# Altium schematic sheet cc_cv_charger.SchDoc
size B
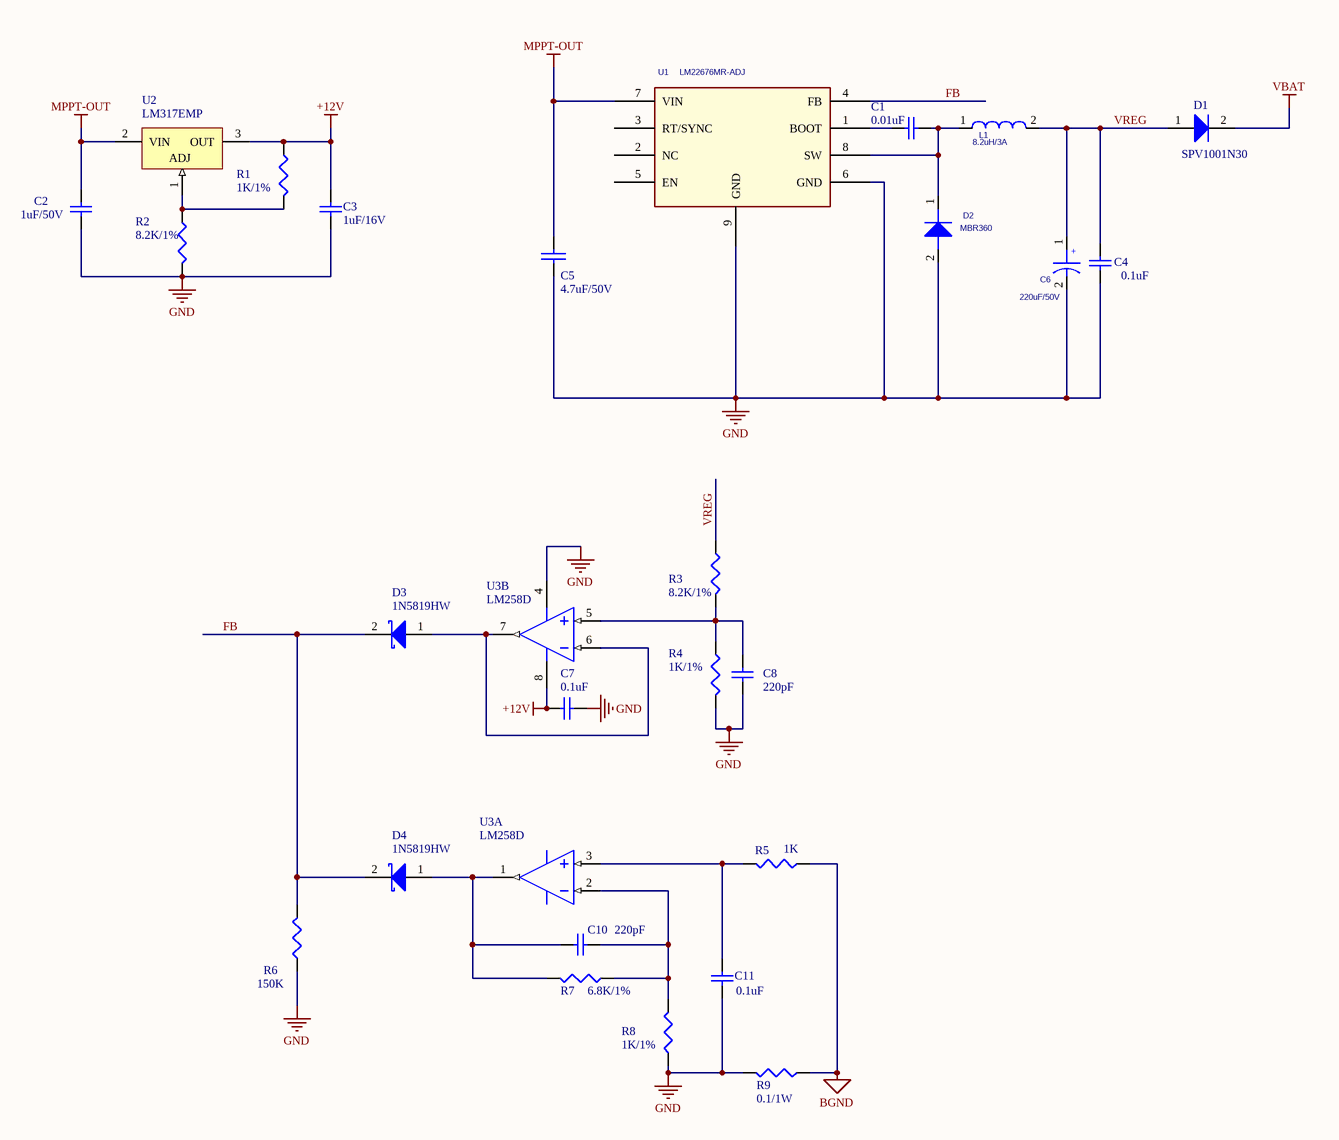
[diagram p0: cc_cv_charger.SchDoc]

## Parts
C1  0.01uF  [0603]
C2  1uF/50V  [1210]
C3  1uF/16V  [0805]
C4  0.1uF  [0603]
C5  4.7uF/50V  [1812]
C6  220uF/50V  [DL-10*10.5]
C7  0.1uF  [0603]
C8  220pF  [0603]
C10  220pF  [0603]
C11  0.1uF  [0603]
D1  SPV1001N30  [SPV1001]
D2  MBR360  [DO214AB]
D3  1N5819HW  [1N5819]
D4  1N5819HW  [1N5819]
L1  8.2uH/3A  [IND_8.2UH_3A]
R1  1K/1%  [0603]
R2  8.2K/1%  [0603]
R3  8.2K/1%  [0603]
R4  1K/1%  [0603]
R5  1K  [0603]
R6  150K  [0603]
R7  6.8K/1%  [0603]
R8  1K/1%  [0603]
R9  0.1/1W  [2512]
U1  LM22676MR-ADJ  [PSO8]
U2  LM317EMP  [LM317]
U3  LM258D  [SO8]  (parts A,B of 2)

## Nets
+12V: C3.2 C7.2 R1.1 U2.3(OUT) U3.8(V+)
BGND: R5.1 R9.1
GND: C2.1 C3.1 C4.1 C5.2 C6.2 C7.1 C8.2 C11.2 D2.2 R2.2 R4.2 R6.1 R8.1 R9.2 U1.6(GND) U1.9(GND) U3.4(GND)
MPPT-OUT: C2.2 C5.1 U1.7(VIN) U2.2(VIN)
VBAT: D1.2(K)
FB: D3.2(K) D4.2(K) R6.2 U1.4(FB)
VREG: C4.2 C6.1 D1.1(A) L1.2 R3.1
NetC1_1: C1.1 D2.1 L1.1 U1.8(SW)
NetC1_2: C1.2 U1.1(BOOT)
NetC8_1: C8.1 R3.2 R4.1 U3.5(INB+)
NetC10_1: C10.1 R7.1 R8.2 U3.2(INA-)
NetC10_2: C10.2 D4.1(A) R7.2 U3.1(OUTA)
NetC11_1: C11.1 R5.2 U3.3(INA+)
NetD3_1: D3.1(A) U3.6(INB-) U3.7(OUTB)
NetR1_2: R1.2 R2.1 U2.1(ADJ)

Not connected (* = marked no-connect by the designer): U1 2(NC) 3(RT/SYNC) 5(EN)

## Notes on the sheet
- (in symbol CAP WP) +

## Library data of the parts
C1-C3 = Cap: Capacitor; Value: 0.1uF; Published: 8-Jun-2000; LatestRevisionDate: 17-Jul-2002; LatestRevisionNote: Re-released for DXP Platform.; PackageReference: RAD-0.3; Publisher: Altium Limited; PackageDescription: Radial Cap, Thru-Hole; 2 Leads; 0.3 in Pin Spacing
C4 C7 C11 = Cap: Capacitor; Published: 8-Jun-2000; LatestRevisionDate: 17-Jul-2002; LatestRevisionNote: Re-released for DXP Platform.; PackageReference: RAD-0.3; Publisher: Altium Limited; PackageDescription: Radial Cap, Thru-Hole; 2 Leads; 0.3 in Pin Spacing; Value: 0.1uF
C5 = CAP: Capacitor
C6 = CAP WP
C8 C10 = Cap: Capacitor; Value: 1000pF; Published: 8-Jun-2000; LatestRevisionDate: 17-Jul-2002; LatestRevisionNote: Re-released for DXP Platform.; PackageReference: RAD-0.3; Publisher: Altium Limited; PackageDescription: Radial Cap, Thru-Hole; 2 Leads; 0.3 in Pin Spacing
D1 = Diode: Default Diode; Published: 8-Jun-2000; LatestRevisionDate: 17-Jul-2002; LatestRevisionNote: Re-released for DXP Platform.; PackageVersion: Sep-1996; PackageReference: SMC; Publisher: Altium Limited; PackageDescription: DO-214-AB/SMC; 2 C-Bend Leads; Body 7.9 x 5.9 mm, inc. leads (LxW); Code_JEDEC: DO-214-AB
D2 = 1N4148WS-7-F_SOD323-2
D3 D4 = Diode 11DQ03: Schottky Rectifier
L1 = 4.7UH_CDH2D09BNP-4R7MC_0.7A_20%: Part Number: SH00000AJ00; ROOM: +1.3V_CORE
R1-R4 R8 = Res3: Resistor; Value: 1K; Published: 8-Jun-2000; LatestRevisionDate: 29-May-2009; LatestRevisionNote: IPC-7351 Footprint Added.; PackageReference: J1-0603; Publisher: Altium Limited; PackageDescription: Chip Resistor
R5 R6 R9 = Res3: Resistor; Published: 8-Jun-2000; LatestRevisionDate: 29-May-2009; LatestRevisionNote: IPC-7351 Footprint Added.; PackageReference: J1-0603; Publisher: Altium Limited; PackageDescription: Chip Resistor
  R5: Value: 1K
  R6: Value: 150K
  R9: Value: 0.1/1W
R7 = Res3: Resistor; Value: 5.1K; Published: 8-Jun-2000; LatestRevisionDate: 29-May-2009; LatestRevisionNote: IPC-7351 Footprint Added.; PackageReference: J1-0603; Publisher: Altium Limited; PackageDescription: Chip Resistor
U1 = LM22670_0
U2 = LM317K STEEL: 3-Terminal Adjustable Regulator, 3-pin TO-3; Manufacturer: National Semiconductor; PackageTopMarking: NS*ZXYTTE#*LM317K*STEELP+; PowerWise: N; CompType: MiscPower; High-Reliability: Y; Published: 4-Dec-2008; DatasheetVersion: Mar-2010; PackageVersion: revG, Oct-1991; PackageReference: K02A; Publisher: Altium Limited; PackageDescription: Metal Can (KA) TO-3, 2 Lead; PartNumber: LM317K STEEL; RoHS: N; PinCount: 2; ComponentLink1Description: LM317 Datasheet; ComponentLink1URL: http://www.national.com/ds/LM/LM317.pdf; ComponentLink2Description: LM317 Web Page; ComponentLink2URL: http://www.national.com/pf/LM/LM317.html; ComponentLink3Description: K02A Package Page; ComponentLink3URL: http://www.national.com/packaging/folders/k02a.html
U3 = LM258H: Low Power Dual Operational Amplifier, 8-pin TO-99; Manufacturer: National Semiconductor; PackageTopMarking: NSZXYTTE# LM258H; PowerWise: N; CompType: Amplifiers; High-Reliability: Y; Published: 4-Dec-2008; DatasheetVersion: Oct-2005; PackageVersion: revF, Jun-1995; PackageReference: H08C; Publisher: Altium Limited; PackageDescription: Metal Can, TO-99, 8 Lead, .200 Dia., P.C.; PartNumber: LM258H; RoHS: N; PinCount: 8; Code_JEDEC: TO-99; ComponentLink1Description: LM258 Datasheet; ComponentLink1URL: http://www.national.com/ds/LM/LM258.pdf; ComponentLink2Description: LM258 Web Page; ComponentLink2URL: http://www.national.com/pf/LM/LM258.html; ComponentLink3Description: H08C Package Page; ComponentLink3URL: http://www.national.com/packaging/folders/h08c.html